# EAGLE design ABMS - VFG - SWITCHES 1 (EAGLE 5.10)
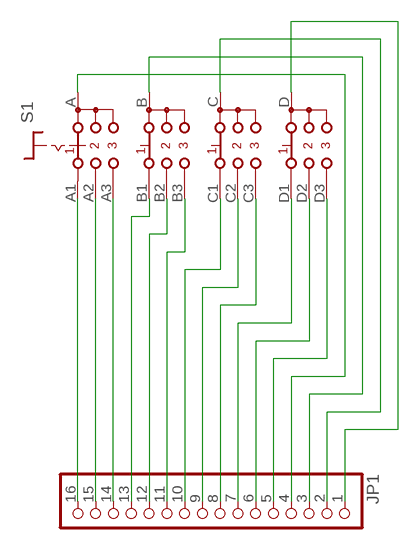
[diagram p0: schematic, sheet 1]

## Parts
JP1  PINHD-1X16  [1X16]
S1  CK104X03  [CK104X03]

## Nets
N$1: JP1.16 S1.A1
N$2: JP1.15 S1.A2
N$3: JP1.14 S1.A3
N$4: JP1.13 S1.B1
N$5: JP1.12 S1.B2
N$6: JP1.11 S1.B3
N$7: JP1.10 S1.C1
N$8: JP1.9 S1.C2
N$9: JP1.8 S1.C3
N$10: JP1.7 S1.D1
N$11: JP1.6 S1.D2
N$12: JP1.5 S1.D3
N$13: JP1.4 S1.A
N$14: JP1.3 S1.B
N$15: JP1.2 S1.C
N$16: JP1.1 S1.D

## Library data of the parts
JP1 = pinhead:PINHD-1X16: PIN HEADER
S1 = switch:CK104X03: ROTARY SWITCH C&K

## Board
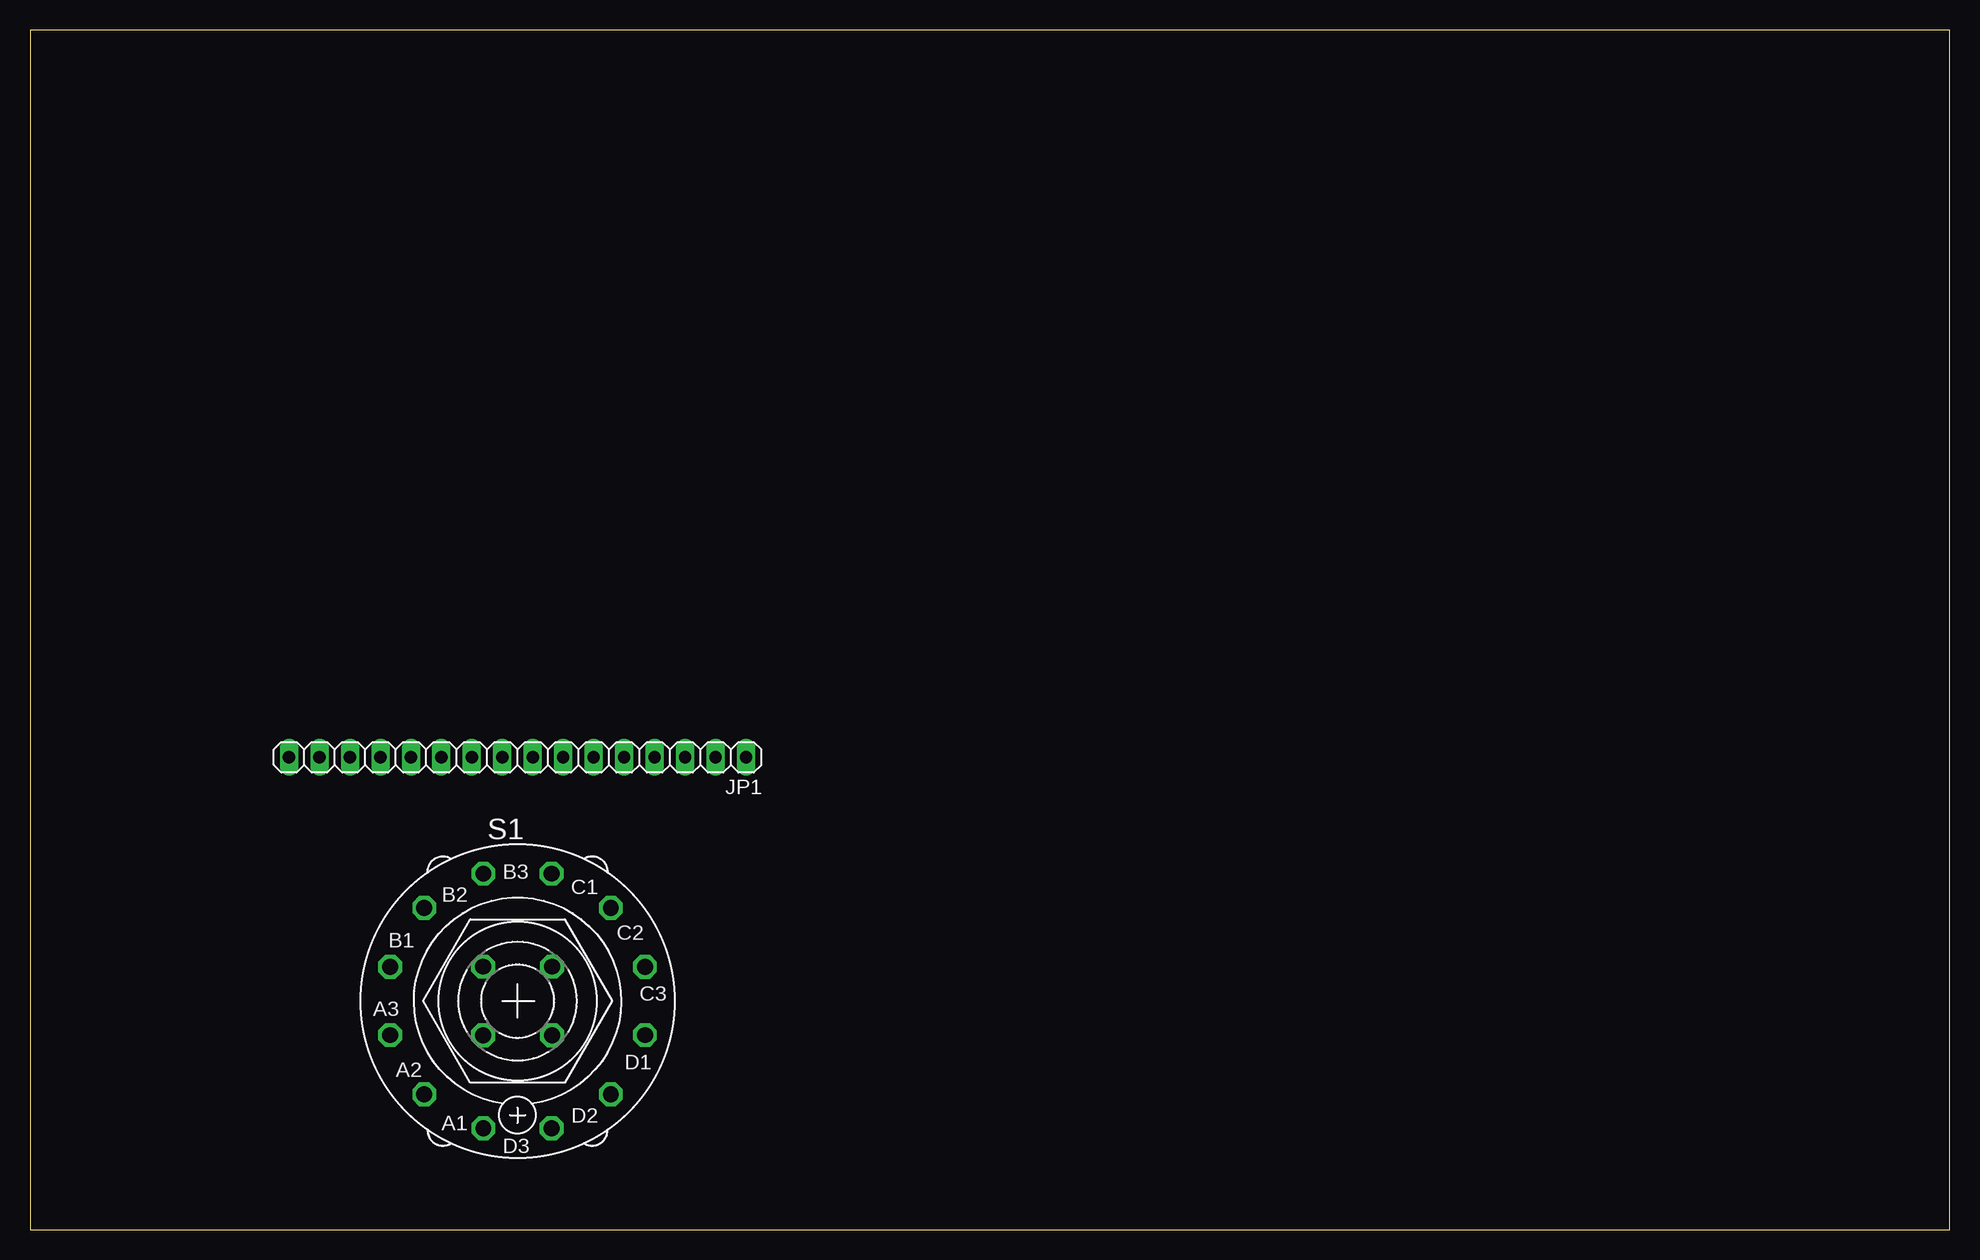
[diagram p1: board, top side]
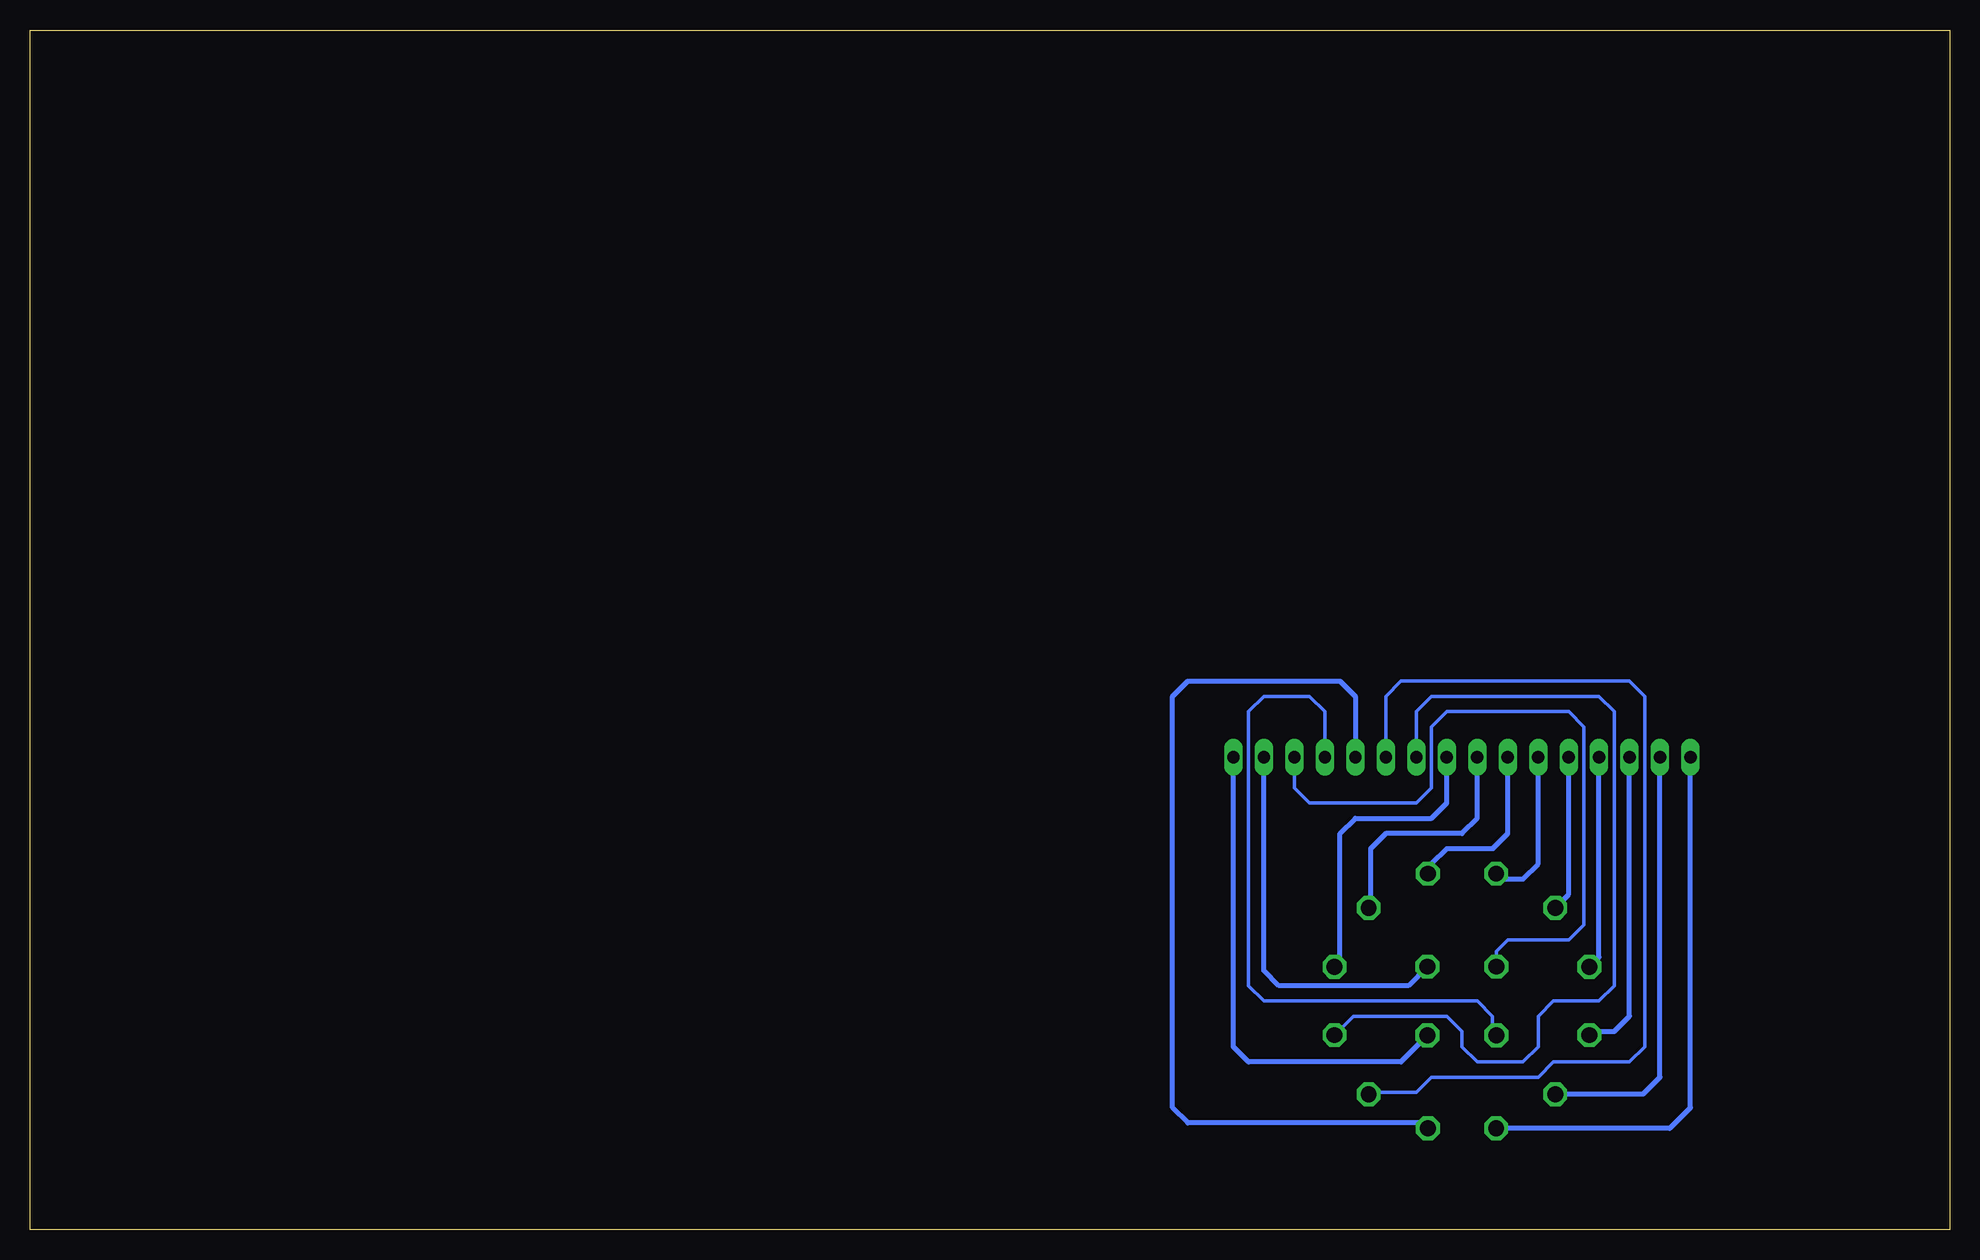
[diagram p2: board, bottom side, seen from below]

Size 160 x 100 mm. Coordinates in mm from the lower left corner, seen from the top.
Outline: 0,0 160,0 160,100 0,100 0,0
Copper layers (1*16): Top 0.035mm / dielectric 1.5mm / Bottom 0.035mm
Design rules "default": minimum track width 10mil, minimum drill 24mil, track to track 8mil, track to pad 8mil, pad to pad 8mil, via to via 8mil, smd to smd 8mil, copper to edge 40mil, drill to drill 8mil, minimum pad ring 10mil, minimum via ring 8mil, stop-mask expansion 4mil, vias tented up to drill 0mil, thermal gap 10mil

### Footprints (pad centres in the part's own frame; a part is rotated, then mirrored left to right if it is on the bottom)
1X16 = drill 1.016 long: 1 -19.05,0; 2 -16.51,0; 3 -13.97,0; 4 -11.43,0; 5 -8.89,0; 6 -6.35,0; 7 -3.81,0; 8 -1.27,0; 9 1.27,0; 10 3.81,0; 11 6.35,0; 12 8.89,0; 13 11.43,0; 14 13.97,0; 15 16.51,0; 16 19.05,0
CK104X03 = drill 1.321 octagon: A -2.87,-2.87; A1 -2.845,-10.617; A2 -7.772,-7.772; A3 -10.617,-2.845; B -2.87,2.87; B1 -10.617,2.845; B2 -7.772,7.772; B3 -2.845,10.617; C 2.87,2.87; C1 2.845,10.617; C2 7.772,7.772; C3 10.617,2.845; D 2.87,-2.87; D1 10.617,-2.845; D2 7.772,-7.772; D3 2.845,-10.617

### Placement (x,y rotation side)
JP1  40.64,39.37 180 top
S1  40.64,19.05 0 top

### Tracks (layer width: path | path; a pad name or v marks a point on that pad's centre or on a via)
N$1
  Bottom 0.406: S1.A1 23.32,8.43 21.59,10.16 JP1.16
N$2
  Bottom 0.406: S1.A2 25.55,11.28 24.13,12.7 JP1.15
N$3
  Bottom 0.406: JP1.14 26.67,17.78 27.94,16.51 29.06,16.51 S1.A3
N$4
  Bottom 0.406: JP1.13 29.21,22.71 S1.B1
N$5
  Bottom 0.406: JP1.12 31.75,27.94 S1.B2
N$6
  Bottom 0.406: JP1.11 34.29,30.48 35.56,29.21 37.34,29.21 S1.B3
N$7
  Bottom 0.406: JP1.10 36.83,33.02 38.1,31.75 41.91,31.75 43.18,30.48 43.18,29.97 S1.C1
N$8
  Bottom 0.406: JP1.9 39.37,34.29 40.64,33.02 46.99,33.02 48.26,31.75 48.26,26.98 S1.C2
N$9
  Bottom 0.406: JP1.8 41.91,35.56 43.18,34.29 49.53,34.29 50.8,33.02 50.8,22.35 S1.C3
N$10
  Bottom 0.305: JP1.7 44.45,43.18 43.18,44.45 29.21,44.45 27.94,43.18 27.94,20.32 29.21,19.05 33.02,19.05 34.29,17.78 34.29,15.24 35.56,13.97 39.37,13.97 40.64,15.24 40.64,16.51 41.91,17.78 49.68,17.78 S1.D1
N$11
  Bottom 0.305: JP1.6 46.99,44.45 45.72,45.72 26.67,45.72 25.4,44.45 25.4,15.24 26.67,13.97 33.02,13.97 34.29,12.7 43.18,12.7 44.45,11.43 48.26,11.43 S1.D2
N$12
  Bottom 0.406: JP1.5 49.53,44.45 50.8,45.72 63.5,45.72 64.77,44.45 64.77,10.16 63.5,8.89 43.94,8.89 S1.D3
N$13
  Bottom 0.305: JP1.4 52.07,43.18 53.34,44.45 57.15,44.45 58.42,43.18 58.42,20.32 57.15,19.05 39.37,19.05 38.1,17.78 38.1,16.51 S1.A
N$14
  Bottom 0.305: S1.B 37.77,23.19 36.83,24.13 31.75,24.13 30.48,25.4 30.48,41.91 31.75,43.18 41.91,43.18 43.18,41.91 43.18,36.83 44.45,35.56 53.34,35.56 54.61,36.83 JP1.3
N$15
  Bottom 0.406: JP1.2 57.15,21.59 55.88,20.32 45.11,20.32 S1.C
N$16
  Bottom 0.406: JP1.1 59.69,15.24 58.42,13.97 45.72,13.97 S1.D